# Altium schematic sheet wifi.SchDoc
size A
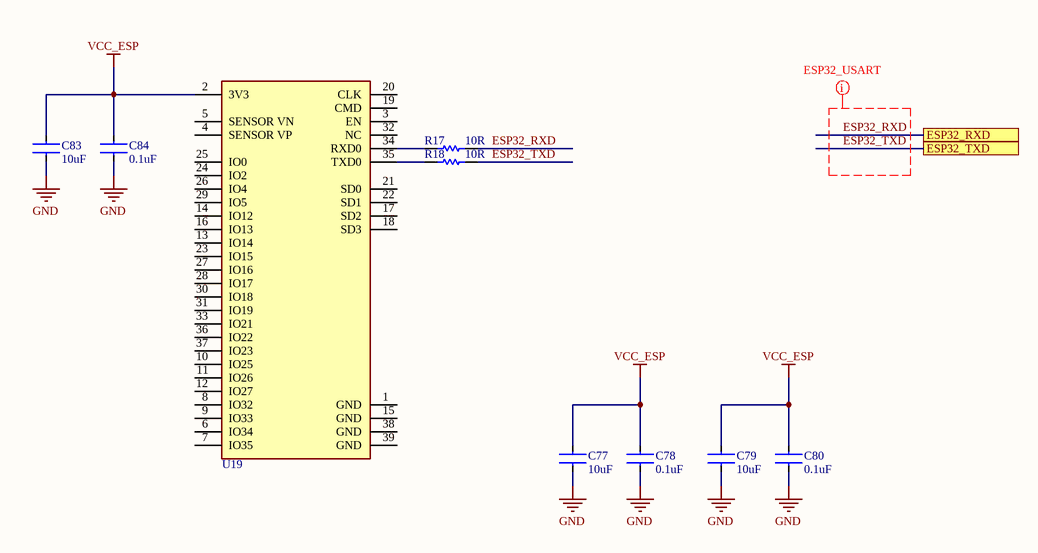
[diagram p0: wifi.SchDoc]

## Parts
C77  10uF  [C0402]
C78  0.1uF  [C0402]
C79  10uF  [C0402]
C80  0.1uF  [C0402]
C83  10uF  [C0402]
C84  0.1uF  [C0402]
R17  10R  [R0402]
R18  10R  [R0402]
U19  BLE/WIFI Module  [Espressif_ESP-WROOM-32_0]  (value not drawn)

## Ports
ESP32_RXD, ESP32_TXD

## Nets
GND: C77.2 C78.2 C79.2 C80.2 C83.2 C84.2
VCC_ESP: C77.1 C78.1 C79.1 C80.1 C83.1 C84.1 U19.2(3V3)
ESP32_RXD: R17.2 ; port ESP32_RXD
ESP32_TXD: R18.2 ; port ESP32_TXD
NetR17_1: R17.1 U19.34(RXD0)
NetR18_1: R18.1 U19.35(TXD0)

Not connected (* = marked no-connect by the designer): U19 1(GND) 3(EN) 4(SENSOR_VP) 5(SENSOR_VN) 6(IO34) 7(IO35) 8(IO32) 9(IO33) 10(IO25) 11(IO26) 12(IO27) 13(IO14) 14(IO12) 15(GND) 16(IO13) 17(SD2) 18(SD3) 19(CMD) 20(CLK) 21(SD0) 22(SD1) 23(IO15) 24(IO2) 25(IO0) 26(IO4) 27(IO16) 28(IO17) 29(IO5) 30(IO18) 31(IO19) 32(NC) 33(IO21) 36(IO22) 37(IO23) 38(GND) 39(GND)

## Layout directives
net class USP32_USART: ESP32_RXD, ESP32_TXD

## Library data of the parts
C77 C79 C83 = CL31B106KOHNNNE: Cap Ceramic 10uF 16V X7R 10% Pad SMD 1206 125°C T/R; Manufacturer: Samsung; Supplier 1: Future Electronics; Manufacturer Part Number: CL31B106KOHNNNE; RoHS: Yes; Category: Ceramic Capacitors; Stock 1: 116000; Pricing 1: 2000=0.03800, 6000=0.03460, 8000=0.03450, 20000=0.03420, 30000=0.03400 (USD); Mount: Surface Mount; Case/Package: 1206; Case Code (Metric): 3216; Case Code (Imperial): 1206; Material: Ceramic; Contact Plating: Tin; Min Operating Temperature: -55°C; Max Operating Temperature: 125°C; Capacitance: 10uF; Tolerance: 10%; Dielectric: X7R; Package Quantity: 1; Packaging: Tape and Reel; Voltage Rating: 16V; Series: CL; Length: 3.2mm; Width: 0.063inch; Height: 1.6mm; Thickness: 0.071inch; Depth: 1.6mm; RoHS Compliant: Yes; ComponentLink1URL: https://datasheet.ciiva.com/25795/cl31b106kohnnne-25795201.pdf?src-supplier=Digi-Key; ComponentLink1Description: https://datasheet.ciiva.com/25795/cl31b106kohnnne-25795201.pdf?src-supplier=Digi-Key; ComponentLink2URL: https://datasheet.ciiva.com/29201/452535-da-01-en-vs-kondensator-1206-29201132.pdf?src-supplier=Conrad; ComponentLink2Description: https://datasheet.ciiva.com/29201/452535-da-01-en-vs-kondensator-1206-29201132.pdf?src-supplier=Conrad; Supplier Part Number 1: 2558872
C78 C80 C84 = CL31B104KBCNNNC: Ceramic capacitor SMD-1206 100nF /50V X7R# K +-10%, Samsung, RoHS; Tolerance: 10%; Dielectric: X7R; Voltage: 50V; Supplier 1: Arrow Electronics; Manufacturer: Samsung; Manufacturer Part Number: CL31B104KBCNNNC; RoHS: Yes; Category: Ceramic Capacitors; Stock 1: 3508000; Pricing 1: 4000=0.02060, 8000=0.01660 (USD); Mount: Surface Mount; Case/Package: 1206; Case Code (Metric): 3216; Case Code (Imperial): 1206; Material: Ceramic; Contact Plating: Tin; Min Operating Temperature: -55°C; Max Operating Temperature: 125°C; Capacitance: 100nF; Voltage Rating (DC): 50V; Packaging: Tape and Reel; Voltage Rating: 50V; Series: CL; Length: 3.2mm; Width: 0.063inch; Height: 0.85mm; Depth: 1.6mm; Thickness: 0.037inch; Radiation Hardening: No; Lead Free: Lead Free; RoHS Compliant: Yes; ComponentLink1URL: https://datasheet.ciiva.com/25710/cl31b104kbcnnnc-25710293.pdf?src-supplier=Digi-Key; ComponentLink1Description: https://datasheet.ciiva.com/25710/cl31b104kbcnnnc-25710293.pdf?src-supplier=Digi-Key; ComponentLink2URL: https://datasheet.ciiva.com/29201/451941-da-01-en-vs-kondensator-1206-29201689.pdf?src-supplier=Conrad; ComponentLink2Description: https://datasheet.ciiva.com/29201/451941-da-01-en-vs-kondensator-1206-29201689.pdf?src-supplier=Conrad; ComponentLink3URL: https://datasheet.ciiva.com/16298/cl05b104kq5nnnc-16298186.pdf?src-supplier=Future+Electronics; ComponentLink3Description: https://datasheet.ciiva.com/16298/cl05b104kq5nnnc-16298186.pdf?src-supplier=Future+Electronics; Supplier Part Number 1: CL31B104KBCNNNC
R17 R18 = RC1206FR-0710RL: Res Thick Film 1206 10 Ohm 1% 0.25W(1/4W) +/-200ppm/ßC Epoxy SMD T/R; Manufacturer: Yageo; Temperature Coefficient: 200ppm/°C; Voltage Rating (DC): 200V; Power Rating: 250mW; Supplier 1: Arrow Electronics; Manufacturer Part Number: RC1206FR-0710RL; RoHS: Yes; Category: Chip SMD Resistors; Stock 1: 60000; Pricing 1: 5000=0.02280 (USD); Case/Package: 1206; Number of Pins: 2; Case Code (Metric): 3216; Case Code (Imperial): 1206; Size Code: 1206; Min Operating Temperature: -55°C; Max Operating Temperature: 155°C; Tolerance: 1%; Resistance: 10R; Resistor Type: Thick Film; Packaging: Tape and Reel; Package Quantity: 1; Voltage Rating: 200V; Number of Terminations: 2; Termination: SMD/SMT; Max Power Dissipation: 250mW; Features: Moisture Resistant; Series: RC; Resistance Tolerance: 1%; Technology: THICK FILM; Construction: Rectangular; Length: 3.1mm; Width: 0.063inch; Height: 0.026inch; Depth: 1.6mm; REACH SVHC: Unknown; Lead Free: Lead Free; Military Standard: Not; RoHS Compliant: Yes; ComponentLink1URL: https://datasheet.ciiva.com/11819/0900766b80c6630a-11819896.pdf?src-supplier=RSComponents; ComponentLink1Description: https://datasheet.ciiva.com/11819/0900766b80c6630a-11819896.pdf?src-supplier=RSComponents; ComponentLink2URL: https://datasheet.ciiva.com/22735/444357-22735648.pdf?src-supplier=Farnell; ComponentLink2Description: https://datasheet.ciiva.com/22735/444357-22735648.pdf?src-supplier=Farnell; ComponentLink3URL: https://datasheet.ciiva.com/29181/402303-da-01-en-smd-widerstand-chip1206-10-ohm-29181572.pdf?src-supplier=Conrad; ComponentLink3Description: https://datasheet.ciiva.com/29181/402303-da-01-en-smd-widerstand-chip1206-10-ohm-29181572.pdf?src-supplier=Conrad; ComponentLink4URL: https://datasheet.ciiva.com/46445/444357-46445704.pdf?src-supplier=Element14; ComponentLink4Description: https://datasheet.ciiva.com/46445/444357-46445704.pdf?src-supplier=Element14; ComponentLink5URL: https://datasheet.ciiva.com/2460/pyu-rc1206-51-rohs-l-4-2460049.pdf?src-supplier=Digi-Key; ComponentLink5Description: https://datasheet.ciiva.com/2460/pyu-rc1206-51-rohs-l-4-2460049.pdf?src-supplier=Digi-Key; ComponentLink6URL: https://datasheet.ciiva.com/2460/pyu-rc1206-51-rohs-l-4-2460050.pdf?src-supplier=Digi-Key; ComponentLink6Description: https://datasheet.ciiva.com/2460/pyu-rc1206-51-rohs-l-4-2460050.pdf?src-supplier=Digi-Key; ComponentLink7URL: https://datasheet.ciiva.com/2460/pyu-rc1206-51-rohs-l-4-2460048.pdf?src-supplier=Digi-Key; ComponentLink7Description: https://datasheet.ciiva.com/2460/pyu-rc1206-51-rohs-l-4-2460048.pdf?src-supplier=Digi-Key; ComponentLink8URL: https://datasheet.ciiva.com/16962/pyu-rc1206-51-rohs-l-4-16962857.pdf?src-supplier=Future+Electronics; ComponentLink8Description: https://datasheet.ciiva.com/16962/pyu-rc1206-51-rohs-l-4-16962857.pdf?src-supplier=Future+Electronics; Supplier Part Number 1: RC1206FR-0710RL
U19 = IC_Espressif_ESP-WROOM-32_eec: IC SPRESSIF ESP32 BLUETOOTH WIFI Module; helpURL: https://upverter.com/upn/revision/247263e65b82b491/; ComponentLink2Description: Datasheet; Temperature: -40°C to +85°C; Package: MOD_SMT; Supplier 2: Mouser; Supplier 1: Digi-Key; ComponentLink1URL: https://upverter.com/upn/revision/247263e65b82b491/; Supplier Part Number 2: 485-3320; Supplier Part Number 1: 1188-1178-ND; Manufacturer: Espressif; ComponentLink1Description: Upverter; ComponentLink2URL: http://www.espressif.com/sites/default/files/documentation/esp-wroom-32_datasheet_en.pdf; RoHS: TRUE; Mouser Part Number: 485-3320; Temperature Range High: +85°C; Digikey Description: IC SPRESSIF ESP32 BLUETOOTH WIFI M; Digikey Part Number: 1188-1178-ND; Lead Free: yes; Temperature Range Low: -40°C; Part Number: ESP-WROOM-32